# EAGLE schematic 8step_Seq (EAGLE 7.7.0)
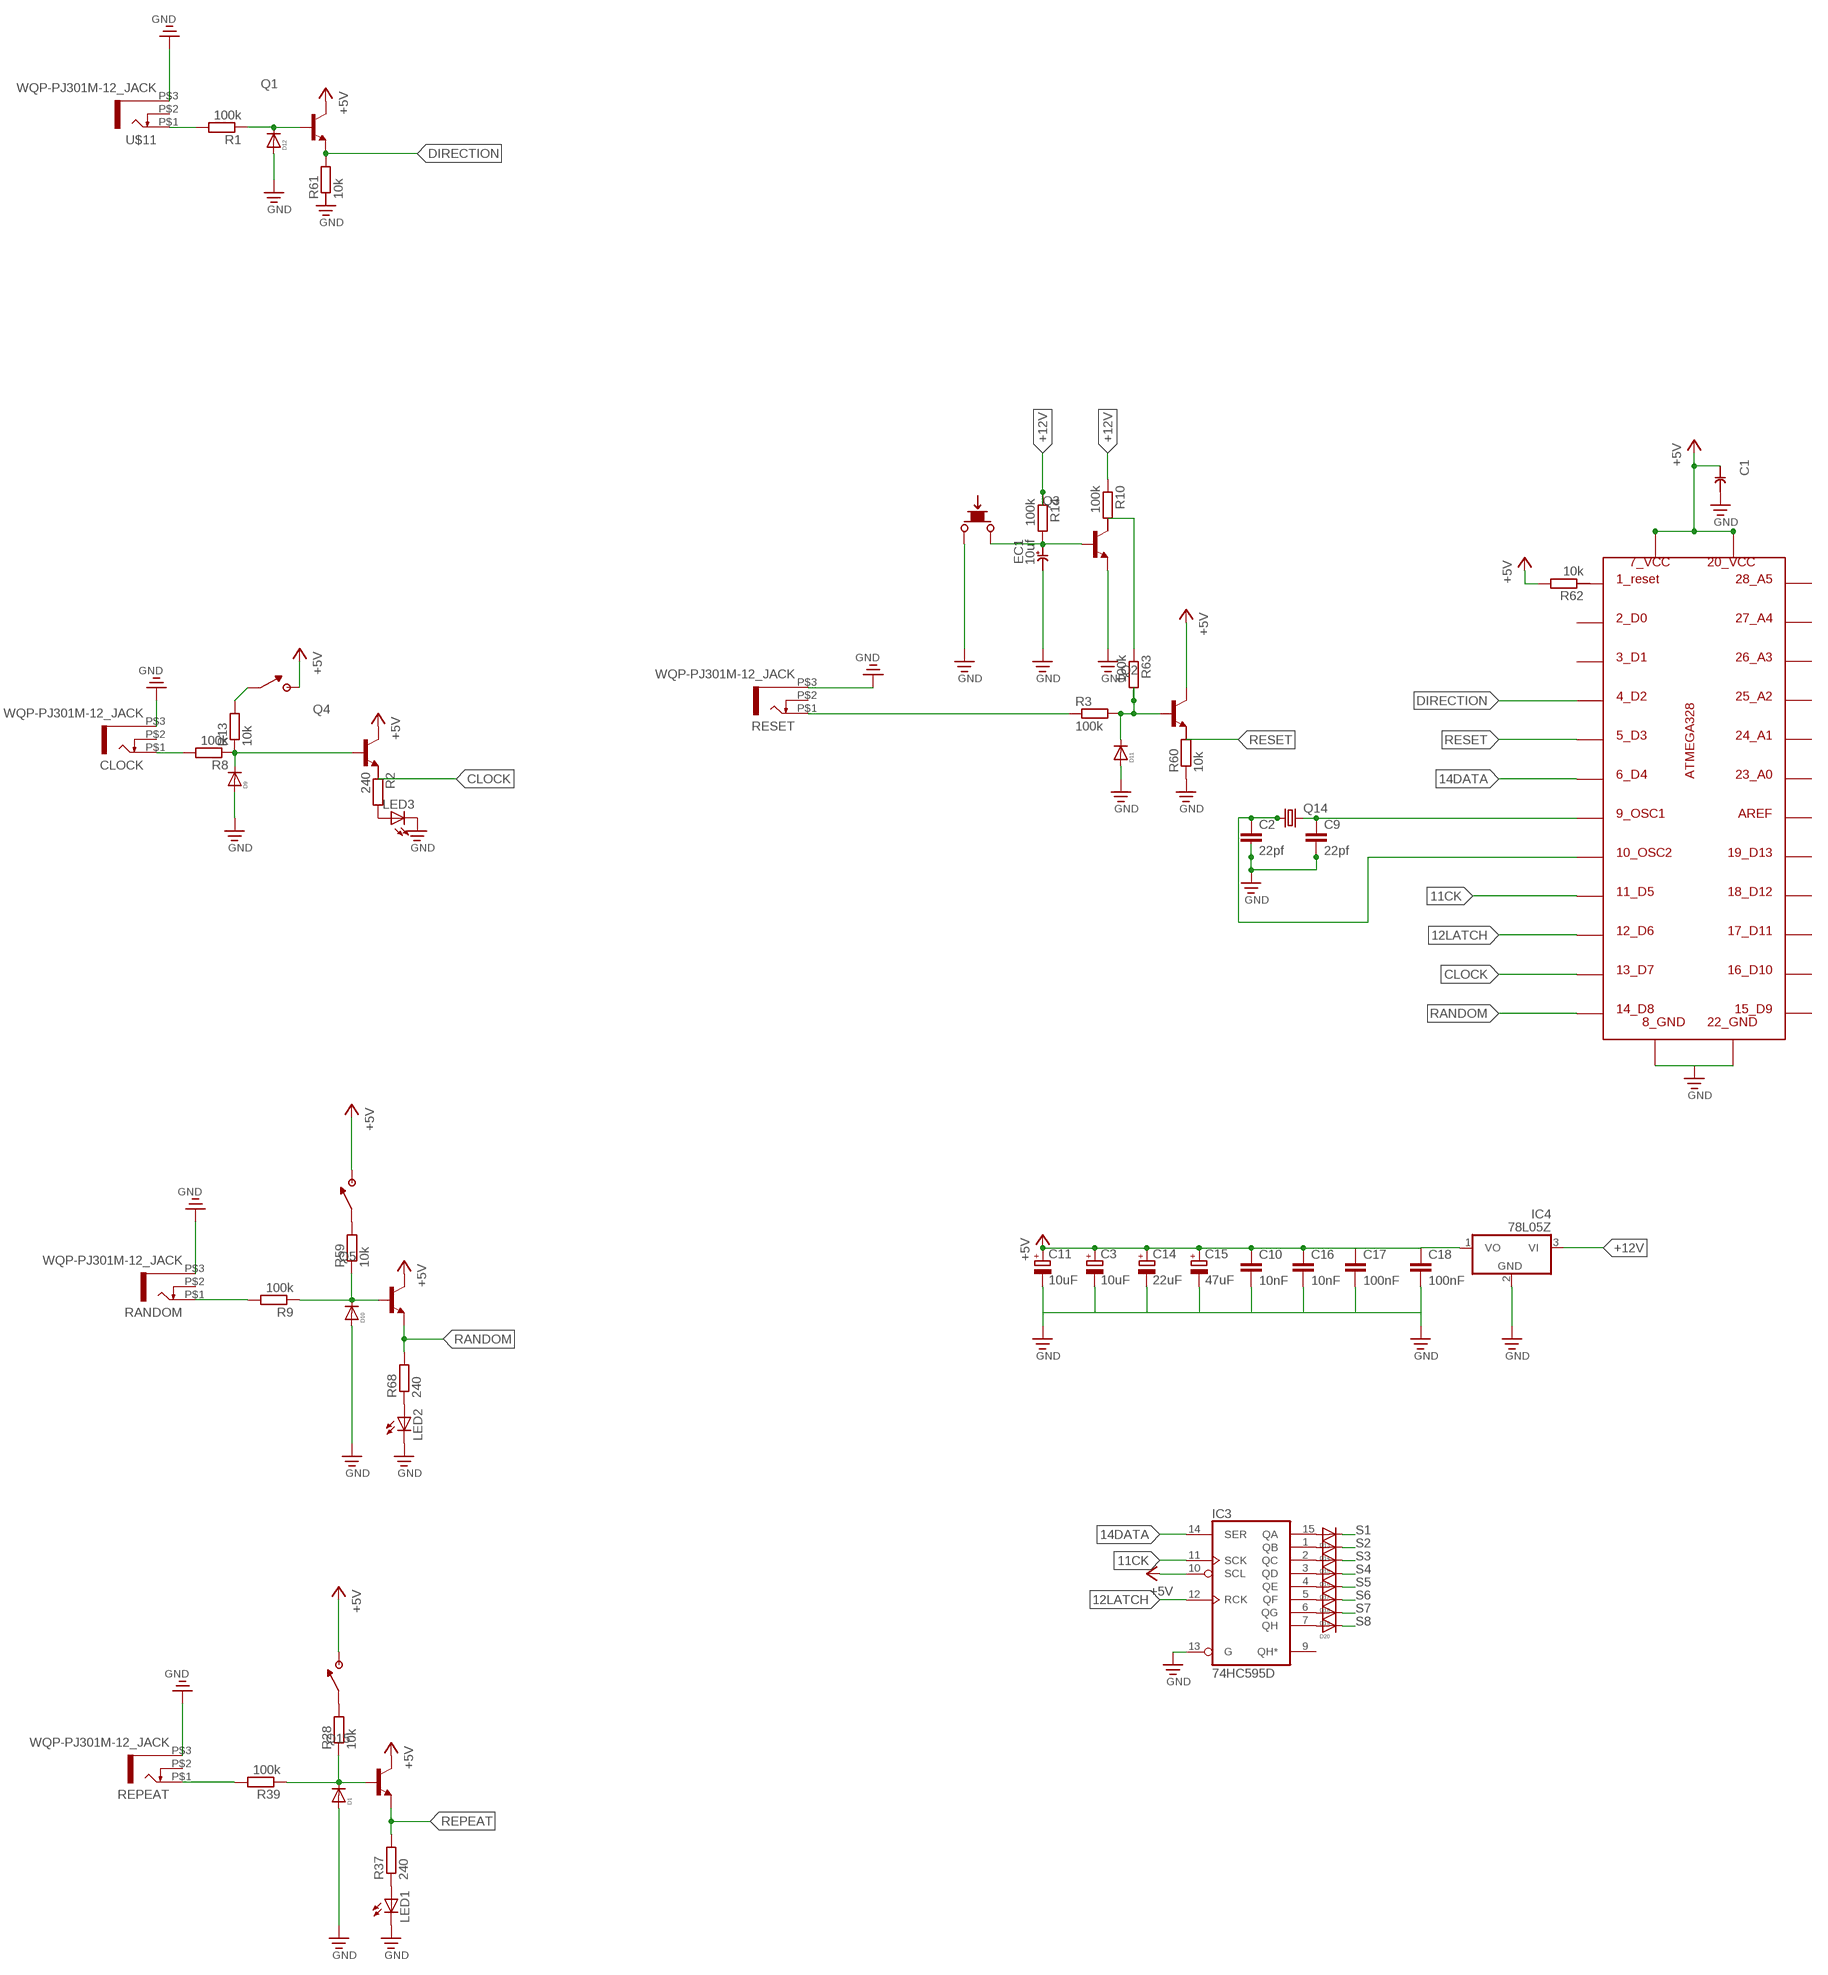
[diagram p0: schematic, sheet 1, part 1 of 2]
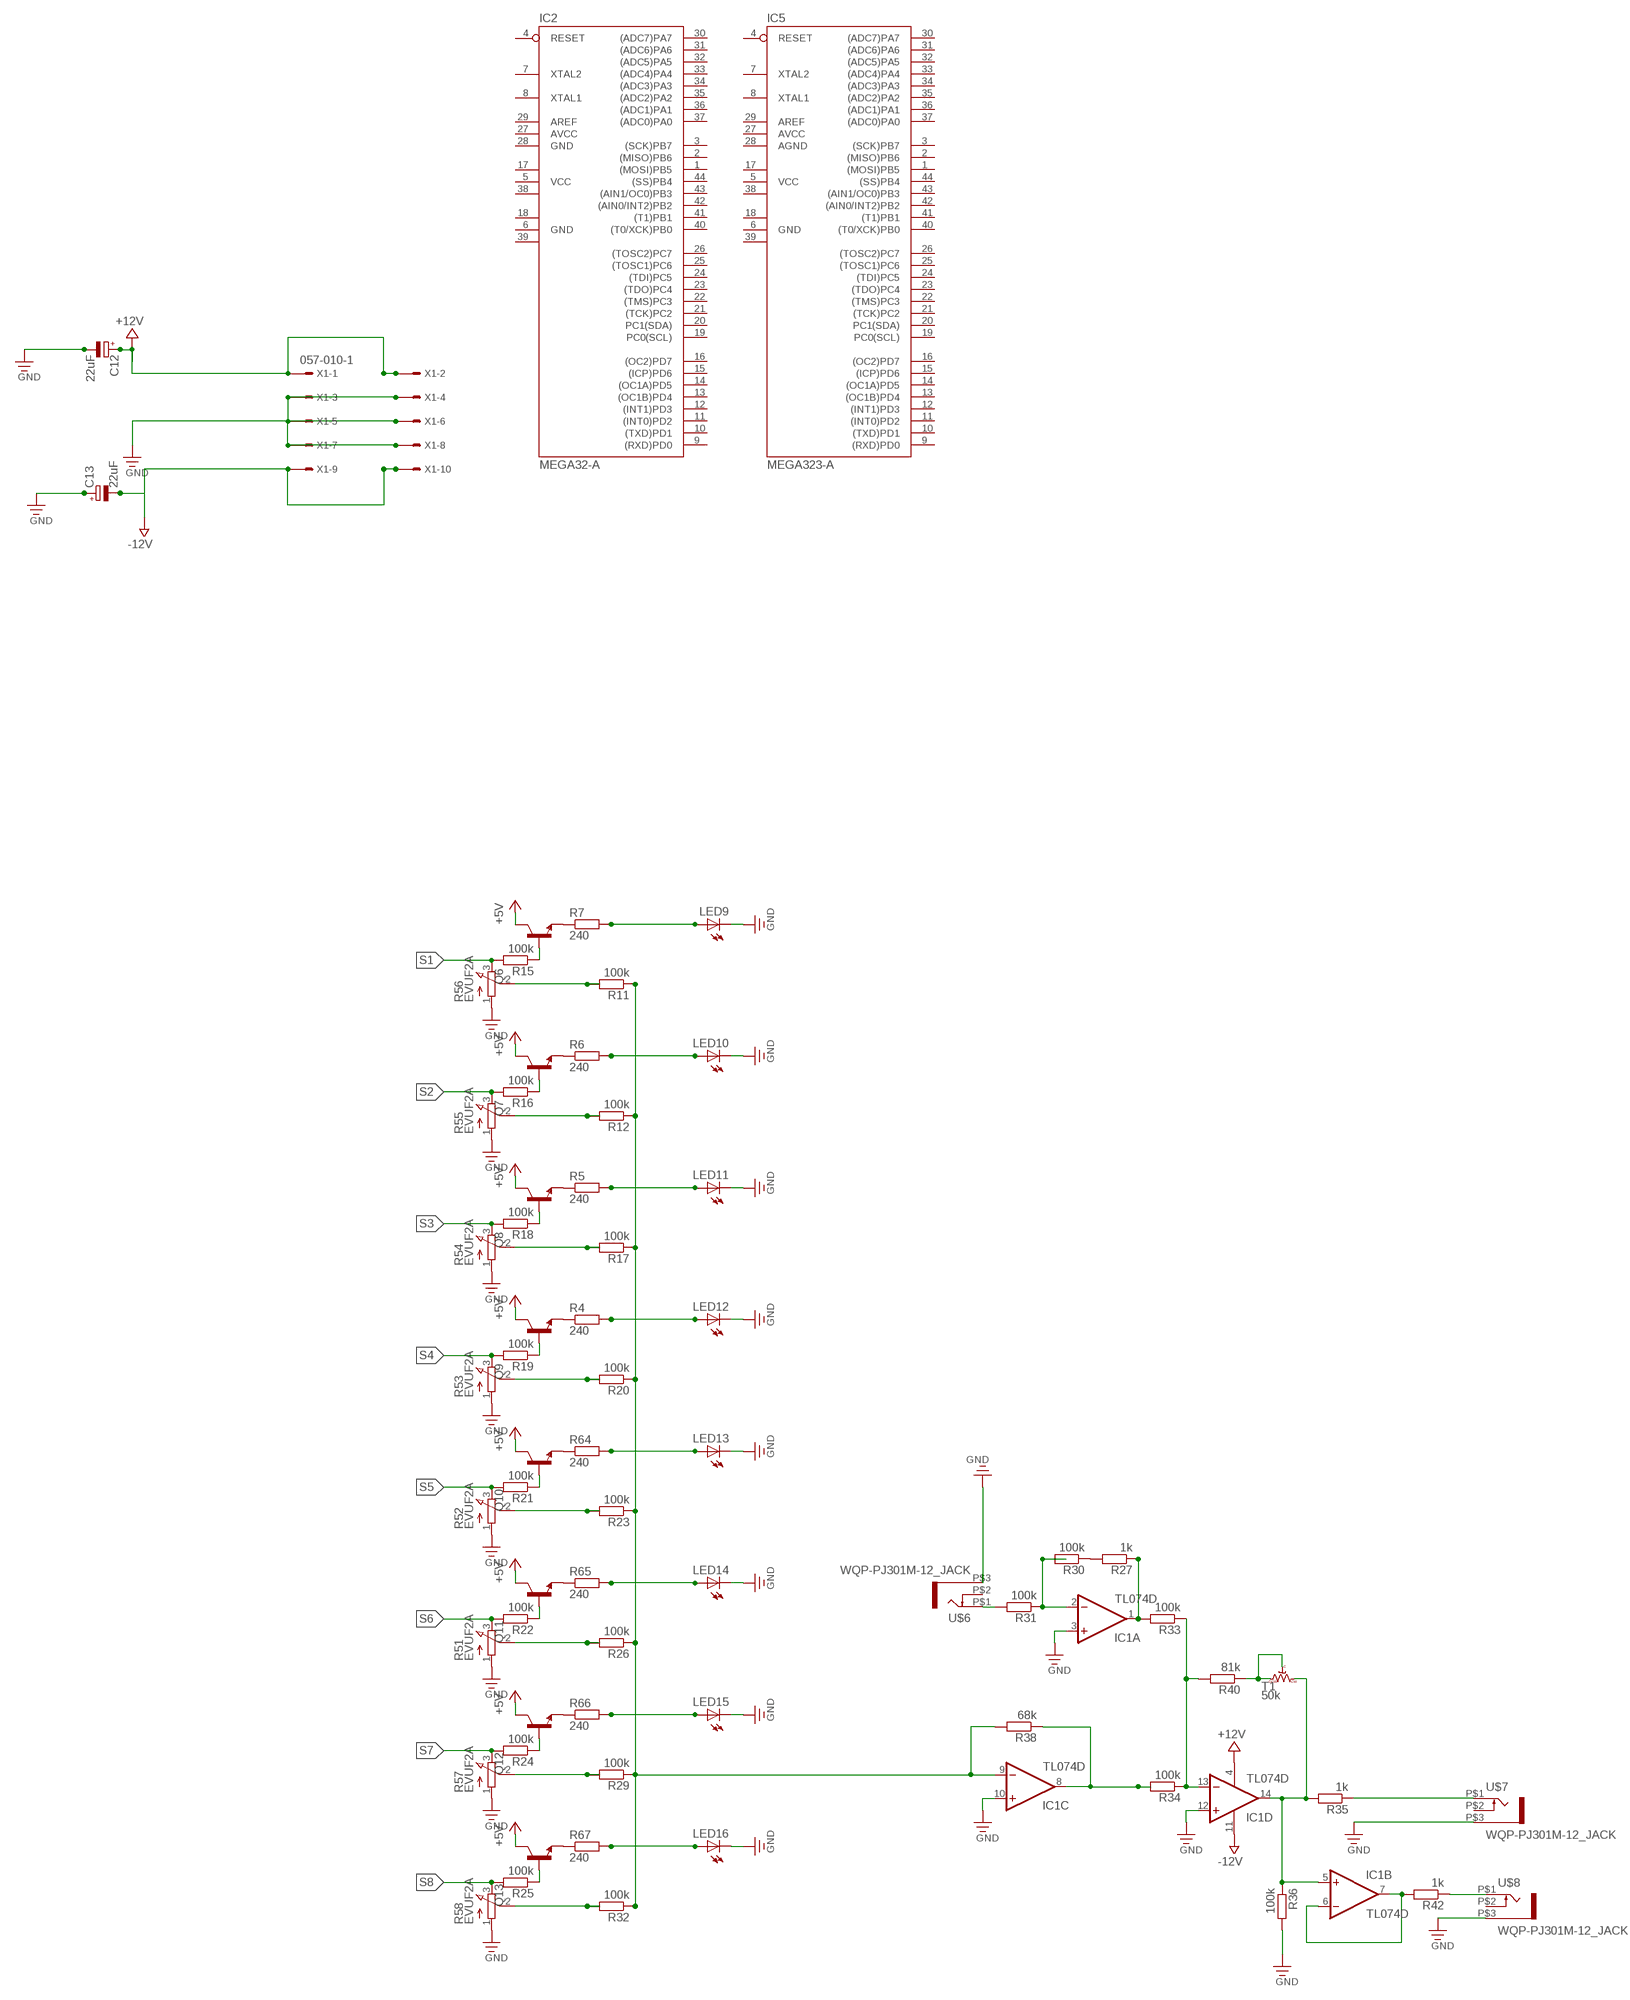
[diagram p1: schematic, sheet 1, part 2 of 2]

## Parts
C1  CAP  [CAP]
C2  22pf  C-EUC0805  [C0805]
C3  10uF  CPOL-EUD  [PANASONIC_D]
C9  22pf  C-EUC0805  [C0805]
C10  10nF  C-EUC0805  [C0805]
C11  10uF  CPOL-EUD  [PANASONIC_D]
C12  22uF  CPOL-EUD  [PANASONIC_D]
C13  22uF  CPOL-EUD  [PANASONIC_D]
C14  22uF  CPOL-EUD  [PANASONIC_D]
C15  47uF  CPOL-EUD  [PANASONIC_D]
C16  10nF  C-EUC0805  [C0805]
C17  100nF  C-EUC0805  [C0805]
C18  100nF  C-EUC0805  [C0805]
CLOCK  WQP-PJ301M-12_JACK  [WQP-PJ301M-12_JACK]
D1  1N4148DO35-7  [DO35-7]
D9  1N4148DO35-7  [DO35-7]
D10  1N4148DO35-7  [DO35-7]
D11  1N4148DO35-7  [DO35-7]
D12  1N4148DO35-7  [DO35-7]
D13  1N4148DO35-10  [DO35-10]
D14  1N4148DO35-10  [DO35-10]
D15  1N4148DO35-10  [DO35-10]
D16  1N4148DO35-10  [DO35-10]
D17  1N4148DO35-10  [DO35-10]
D18  1N4148DO35-10  [DO35-10]
D19  1N4148DO35-10  [DO35-10]
D20  1N4148DO35-10  [DO35-10]
EC1  10uf  E_CAP  [ELECTRO_CAP]
IC1  TL074D  [SO14]
IC2  MEGA32-A  [TQFP44]
IC3  74HC595D  [SO16]
IC4  78L05Z  [TO92]
IC5  MEGA323-A  [TQFP44]
LED1  LEDSML1206  [SML1206]
LED2  LEDSML1206  [SML1206]
LED3  LEDSML1206  [SML1206]
LED9  LEDSML1206  [SML1206]
LED10  LEDSML1206  [SML1206]
LED11  LEDSML1206  [SML1206]
LED12  LEDSML1206  [SML1206]
LED13  LEDSML1206  [SML1206]
LED14  LEDSML1206  [SML1206]
LED15  LEDSML1206  [SML1206]
LED16  LEDSML1206  [SML1206]
Q1  BC817-16LT1-NPN-SOT23-BEC  [SOT23-BEC]
Q2  BC817-16LT1-NPN-SOT23-BEC  [SOT23-BEC]
Q3  BC817-16LT1-NPN-SOT23-BEC  [SOT23-BEC]
Q4  BC817-16LT1-NPN-SOT23-BEC  [SOT23-BEC]
Q5  BC817-16LT1-NPN-SOT23-BEC  [SOT23-BEC]
Q6  BC817-16LT1-NPN-SOT23-BEC  [SOT23-BEC]
Q7  BC817-16LT1-NPN-SOT23-BEC  [SOT23-BEC]
Q8  BC817-16LT1-NPN-SOT23-BEC  [SOT23-BEC]
Q9  BC817-16LT1-NPN-SOT23-BEC  [SOT23-BEC]
Q10  BC817-16LT1-NPN-SOT23-BEC  [SOT23-BEC]
Q11  BC817-16LT1-NPN-SOT23-BEC  [SOT23-BEC]
Q12  BC817-16LT1-NPN-SOT23-BEC  [SOT23-BEC]
Q13  BC817-16LT1-NPN-SOT23-BEC  [SOT23-BEC]
Q14  CRYSTALHC49S  [HC49/S]
Q15  BC817-16LT1-NPN-SOT23-BEC  [SOT23-BEC]
R1  100k  R-EU_R0805  [R0805]
R2  240  R-EU_R0805  [R0805]
R3  100k  R-EU_R0805  [R0805]
R4  240  R-EU_R0805  [R0805]
R5  240  R-EU_R0805  [R0805]
R6  240  R-EU_R0805  [R0805]
R7  240  R-EU_R0805  [R0805]
R8  100k  R-EU_R0805  [R0805]
R9  100k  R-EU_R0805  [R0805]
R10  100k  R-EU_R0805  [R0805]
R11  100k  R-EU_R0805  [R0805]
R12  100k  R-EU_R0805  [R0805]
R13  10k  R-EU_R0805  [R0805]
R14  100k  R-EU_R0805  [R0805]
R15  100k  R-EU_R0805  [R0805]
R16  100k  R-EU_R0805  [R0805]
R17  100k  R-EU_R0805  [R0805]
R18  100k  R-EU_R0805  [R0805]
R19  100k  R-EU_R0805  [R0805]
R20  100k  R-EU_R0805  [R0805]
R21  100k  R-EU_R0805  [R0805]
R22  100k  R-EU_R0805  [R0805]
R23  100k  R-EU_R0805  [R0805]
R24  100k  R-EU_R0805  [R0805]
R25  100k  R-EU_R0805  [R0805]
R26  100k  R-EU_R0805  [R0805]
R27  1k  R-EU_R0805  [R0805]
R28  10k  R-EU_R0805  [R0805]
R29  100k  R-EU_R0805  [R0805]
R30  100k  R-EU_R0805  [R0805]
R31  100k  R-EU_R0805  [R0805]
R32  100k  R-EU_R0805  [R0805]
R33  100k  R-EU_R0805  [R0805]
R34  100k  R-EU_R0805  [R0805]
R35  1k  R-EU_R0805  [R0805]
R36  100k  R-EU_R0805  [R0805]
R37  240  R-EU_R0805  [R0805]
R38  68k  R-EU_R0805  [R0805]
R39  100k  R-EU_R0805  [R0805]
R40  81k  R-EU_R0805  [R0805]
R42  1k  R-EU_R0805  [R0805]
R51  EVUF2A  [EVUF]
R52  EVUF2A  [EVUF]
R53  EVUF2A  [EVUF]
R54  EVUF2A  [EVUF]
R55  EVUF2A  [EVUF]
R56  EVUF2A  [EVUF]
R57  EVUF2A  [EVUF]
R58  EVUF2A  [EVUF]
R59  10k  R-EU_R0805  [R0805]
R60  10k  R-EU_R0805  [R0805]
R61  10k  R-EU_R0805  [R0805]
R62  10k  R-EU_R0805  [R0805]
R63  100k  R-EU_R0805  [R0805]
R64  240  R-EU_R0805  [R0805]
R65  240  R-EU_R0805  [R0805]
R66  240  R-EU_R0805  [R0805]
R67  240  R-EU_R0805  [R0805]
R68  240  R-EU_R0805  [R0805]
RANDOM  WQP-PJ301M-12_JACK  [WQP-PJ301M-12_JACK]
RANDOMS  SPST  [SPST]
RANDOMS1  SPST  [SPST]
REPEAT  WQP-PJ301M-12_JACK  [WQP-PJ301M-12_JACK]
RESET  WQP-PJ301M-12_JACK  [WQP-PJ301M-12_JACK]
STEP  SPST_MOMENTARY  [SPST]
T1  50k  TRIM  [TRIM]
TOGGLE  SPST  [SPST]
U$2  ATMEGA328  [DIL28]
U$6  WQP-PJ301M-12_JACK  [WQP-PJ301M-12_JACK]
U$7  WQP-PJ301M-12_JACK  [WQP-PJ301M-12_JACK]
U$8  WQP-PJ301M-12_JACK  [WQP-PJ301M-12_JACK]
U$11  WQP-PJ301M-12_JACK  [WQP-PJ301M-12_JACK]
X1  057-010-1  [057-010-1]

## Nets
11CK: IC3.11(SCK) U$2.P$11(P$11_D5)
12LATCH: IC3.12(RCK) U$2.P$12(P$12_D6)
14DATA: IC3.14(SER) U$2.P$6(P$6_D4)
+5V: C1.P$1 C3.+ C10.1 C11.+ C14.+ C15.+ C16.1 C18.1 IC3.10(SCL) IC4.1(VO) Q1.C Q2.C Q4.C Q5.C Q6.C Q7.C Q8.C Q9.C Q10.C Q11.C Q12.C Q13.C Q15.C R62.2 RANDOMS1.P$2 RANDOMS.P$2 TOGGLE.P$2 U$2.P$7(P$7_VCC) U$2.P$20(P$20_VCC)
+12V: C12.+ IC1.4(P:V+) IC4.3(VI) R10.1 R14.1 X1.1 X1.2
-12V: C13.- IC1.11(P:V-) X1.9 X1.10
CLOCK: Q4.E U$2.P$13(P$13_D7)
DIRECTION: Q1.E R61.2 U$2.P$4(P$4_D2)
GND: C1.P$2 C2.2 C3.- C9.2 C10.2 C11.- C12.- C13.+ C14.- C15.- C16.2 C17.2 C18.2 CLOCK.P$3 D1.A D9.A D10.A D11.A D12.A EC1.P$2 IC1.3(A:+IN) IC1.10(C:+IN) IC1.12(D:+IN) IC3.13(G) IC4.2(GND) LED1.C LED2.C LED3.C LED9.C LED10.C LED11.C LED12.C LED13.C LED14.C LED15.C LED16.C Q3.E R36.2 R51.1(A) R52.1(A) R53.1(A) R54.1(A) R55.1(A) R56.1(A) R57.1(A) R58.1(A) R60.1 RANDOM.P$3 REPEAT.P$3 RESET.P$3 STEP.P$2 U$2.P$8(P$8_GND) U$2.P$22(P$22_GND) U$6.P$3 U$7.P$3 U$8.P$3 U$11.P$3 X1.3 X1.4 X1.5 X1.6 X1.7 X1.8
N$1: C9.1 Q14.2 U$2.P$9(P$9_OSC1)
N$2: C2.1 Q14.1 U$2.P$10(P$10_OSC2)
N$3: D13.A IC3.15(QA)
N$4: D14.A IC3.1(QB)
N$5: D15.A IC3.2(QC)
N$6: R27.2 R30.1
N$7: R3.1 RESET.P$1
N$8: D12.C Q1.B R1.1
N$9: R42.1 U$8.P$1
N$10: Q13.E R67.1
N$11: D11.C Q2.B R3.2 R63.2
N$12: Q3.C R63.1
N$13: EC1.P$1 Q3.B R14.2 STEP.P$1
N$14: D1.C Q15.B R28.1 R39.1
N$15: CLOCK.P$1 R8.2
N$16: D9.C Q4.B R8.1 R13.1
N$17: R13.2 TOGGLE.P$1
N$18: R9.2 RANDOM.P$1
N$19: D10.C Q5.B R9.1 R59.1
N$20: R28.2 RANDOMS1.P$1
N$21: R59.2 RANDOMS.P$1
N$22: Q12.E R66.1
N$23: LED1.A R37.1
N$24: R39.2 REPEAT.P$1
N$32: Q13.B R25.1
N$33: R11.2 R56.2(S)
N$34: LED9.A R7.2
N$36: Q12.B R24.1
N$37: R12.2 R55.2(S)
N$38: LED10.A R6.2
N$40: Q11.B R22.1
N$41: R17.2 R54.2(S)
N$42: LED11.A R5.2
N$44: Q10.B R21.1
N$45: R20.2 R53.2(S)
N$46: LED12.A R4.2
N$48: Q9.B R19.1
N$49: R23.2 R52.2(S)
N$50: LED13.A R64.2
N$52: Q8.B R18.1
N$53: R26.2 R51.2(S)
N$54: LED14.A R65.2
N$56: Q7.B R16.1
N$57: R29.2 R57.2(S)
N$58: LED15.A R66.2
N$60: Q6.B R15.1
N$61: R32.2 R58.2(S)
N$62: LED16.A R67.2
N$63: IC1.9(C:-IN) R11.1 R12.1 R17.1 R20.1 R23.1 R26.1 R29.1 R32.1 R38.2
N$64: R35.1 U$7.P$1
N$65: IC1.8(C:OUT) R34.2 R38.1
N$66: IC1.13(D:-IN) R33.1 R34.1 R40.2
N$67: IC1.5(B:+IN) IC1.14(D:OUT) R35.2 R36.1 T1.CW
N$68: R40.1 T1.C T1.CCW
N$69: IC1.1(A:OUT) R27.1 R33.2
N$71: R31.2 U$6.P$1
N$72: IC1.2(A:-IN) R30.2 R31.1
N$74: IC1.6(B:-IN) IC1.7(B:OUT) R42.2
N$79: Q11.E R65.1
N$80: Q10.E R64.1
N$81: Q9.E R4.1
N$82: Q7.E R6.1
N$83: Q6.E R7.1
N$84: LED2.A R68.1
N$85: LED3.A R2.2
N$86: R1.2 U$11.P$1
N$89: Q8.E R5.1
N$90: D16.A IC3.3(QD)
N$91: D17.A IC3.4(QE)
N$92: D18.A IC3.5(QF)
N$93: D19.A IC3.6(QG)
N$94: D20.A IC3.7(QH)
RANDOM: Q5.E R68.2 U$2.P$14(P$14_D8)
REPEAT: Q15.E R37.2
RESET: Q2.E U$2.P$5(P$5_D3)
S1: D13.C R15.2 R56.3(E)
S2: D14.C R16.2 R55.3(E)
S3: D15.C R18.2 R54.3(E)
S4: D16.C R19.2 R53.3(E)
S5: D17.C R21.2 R52.3(E)
S6: D18.C R22.2 R51.3(E)
S7: D19.C R24.2 R57.3(E)
S8: D20.C R25.2 R58.3(E)
Unconnected: C17.1 CLOCK.P$2 IC2.1((MOSI)PB5) IC2.2((MISO)PB6) IC2.3((SCK)PB7) IC2.4(RESET) IC2.7(XTAL2) IC2.8(XTAL1) IC2.9((RXD)PD0) IC2.10((TXD)PD1) IC2.11((INT0)PD2) IC2.12((INT1)PD3) IC2.13((OC1B)PD4) IC2.14((OC1A)PD5) IC2.15((ICP)PD6) IC2.16((OC2)PD7) IC2.19(PC0(SCL)) IC2.20(PC1(SDA)) IC2.21((TCK)PC2) IC2.22((TMS)PC3) IC2.23((TDO)PC4) IC2.24((TDI)PC5) IC2.25((TOSC1)PC6) IC2.26((TOSC2)PC7) IC2.29(AREF) IC2.30((ADC7)PA7) IC2.31((ADC6)PA6) IC2.32((ADC5)PA5) IC2.33((ADC4)PA4) IC2.34((ADC3)PA3) IC2.35((ADC2)PA2) IC2.36((ADC1)PA1) IC2.37((ADC0)PA0) IC2.40((T0/XCK)PB0) IC2.41((T1)PB1) IC2.42((AIN0/INT2)PB2) IC2.43((AIN1/OC0)PB3) IC2.44((SS)PB4) IC3.9(QH*) IC5.1((MOSI)PB5) IC5.2((MISO)PB6) IC5.3((SCK)PB7) IC5.4(RESET) IC5.7(XTAL2) IC5.8(XTAL1) IC5.9((RXD)PD0) IC5.10((TXD)PD1) IC5.11((INT0)PD2) IC5.12((INT1)PD3) IC5.13((OC1B)PD4) IC5.14((OC1A)PD5) IC5.15((ICP)PD6) IC5.16((OC2)PD7) IC5.19(PC0(SCL)) IC5.20(PC1(SDA)) IC5.21((TCK)PC2) IC5.22((TMS)PC3) IC5.23((TDO)PC4) IC5.24((TDI)PC5) IC5.25((TOSC1)PC6) IC5.26((TOSC2)PC7) IC5.29(AREF) IC5.30((ADC7)PA7) IC5.31((ADC6)PA6) IC5.32((ADC5)PA5) IC5.33((ADC4)PA4) IC5.34((ADC3)PA3) IC5.35((ADC2)PA2) IC5.36((ADC1)PA1) IC5.37((ADC0)PA0) IC5.40((T0/XCK)PB0) IC5.41((T1)PB1) IC5.42((AIN0/INT2)PB2) IC5.43((AIN1/OC0)PB3) IC5.44((SS)PB4) R2.1 R10.2 R60.2 R61.1 R62.1 RANDOM.P$2 REPEAT.P$2 RESET.P$2 U$2.P$1(P$1_RESET) U$2.P$2(P$2_D0) U$2.P$3(P$3_D1) U$2.P$15(P$15_D9) U$2.P$16(P$16_D10) U$2.P$17(P$17_D11) U$2.P$18(P$18_D12) U$2.P$19(P$19_D13) U$2.P$21(P$21_AREF) U$2.P$23(P$23_A0) U$2.P$24(P$24_A1) U$2.P$25(P$25_A2) U$2.P$26(P$26_A3) U$2.P$27(P$27_A4) U$2.P$28(P$28_A5) U$6.P$2 U$7.P$2 U$8.P$2 U$11.P$2

## Power pins joined to a net without a drawn wire
AGND: IC5.28(AGND)
AVCC: IC2.27(AVCC) IC5.27(AVCC)
GND: IC2.6(GND) IC2.28(GND) IC3.8(GND) IC5.6(GND)
GND1: IC2.18(GND1) IC5.18(GND1)
GND2: IC2.39(GND2) IC5.39(GND2)
VCC: IC2.5(VCC) IC3.16(VCC) IC5.5(VCC)
VCC1: IC2.17(VCC1) IC5.17(VCC1)
VCC2: IC2.38(VCC2) IC5.38(VCC2)

## Library data of the parts
C1 = 001-etchable:CAP
C2 C9 C10 C16-C18 = resistor:C-EU: CAPACITOR, European symbol
C3 C11-C15 = resistor:CPOL-EU: POLARIZED CAPACITOR, European symbol
CLOCK RANDOM REPEAT RESET U$6-U$8 U$11 = thonkiconn:WQP-PJ301M-12_JACK
D1 D9-D20 = 001-etchable:1N4148: DIODE high speed (Philips)
EC1 = 001-etchable:E_CAP
IC1 = linear:TL074: OP AMP
IC2 = atmel:MEGA32: MICROCONTROLLER 32 Kbytes FLASH 2 Kbytes SRAM 1 Kbytes EEPROM USART 8-channel 10 bit ADC Source: www.atmel.com .. doc2503.pdf; MPN: ATMEGA32-16AU; OC_FARNELL: 9171274; OC_NEWARK: 69K6677
IC3 = 74xx-eu:74*595: 8-bit SHIFT REGISTER, output latch
IC4 = linear:78*: Positive VOLTAGE REGULATOR Source: http://cache.national.com/ds/LM/LM78L05.pdf http://www.fairchildsemi.com/ds/LM/LM7805.pdf
IC5 = atmel:MEGA323: MICROCONTROLLER 32 Kbytes FLASH 2 Kbytes SRAM 1 Kbytes EEPROM USART 8-channel 10 bit ADC Source: avr.lbr; OC_FARNELL: unknown; OC_NEWARK: unknown
LED1-LED3 LED9-LED16 = led:LED: LED OSRAM: - CHIPLED LG R971, LG N971, LY N971, LG Q971, LY Q971, LO R971, LY R971 LH N974, LH R974 LS Q976, LO Q976, LY Q976 LO Q996 - Hyper CHIPLED LW Q18S LB Q993, LB Q99A, LB R99A - SideLED LS A670, LO A670, LY A670, LG A670, LP A670 LB A673, LV A673, LT A673, LW A673 LH A674 LY A675 LS A676, LA A676, LO A676, LY A676, LW A676 LS A679, LY A679, LG A679 - Hyper Micro SIDELED® LS Y876, LA Y876, LO Y876, LY Y876 LT Y87S - SmartLED LW L88C, LW L88S LB L89C, LB L89S, LG L890 LS L89K, LO L89K, LY L89K LS L896, LA L896, LO L896, LY L896 - TOPLED LS T670, LO T670, LY T670, LG T670, LP T670 LSG T670, LSP T670, LSY T670, LOP T670, LYG T670 LG T671, LOG T671, LSG T671 LB T673, LV T673, LT T673, LW T673 LH T674 LS T676, LA T676, LO T676, LY T676, LB T676, LH T676, LSB T676, LW T676 LB T67C, LV T67C, LT T67C, LS T67K, LO T67K, LY T67K, LW E67C LS E67B, LA E67B, LO E67B, LY E67B, LB E67C, LV E67C, LT E67C LW T67C LS T679, LY T679, LG T679 LS T770, LO T770, LY T770, LG T770, LP T770 LB T773, LV T773, LT T773, LW T773 LH T774 LS E675, LA E675, LY E675, LS T675 LS T776, LA T776, LO T776, LY T776, LB T776 LHGB T686 LT T68C, LB T68C - Hyper Mini TOPLED® LB M676 - Mini TOPLED Santana® LG M470 LS M47K, LO M47K, LY M47K Source: http://www.osram.convergy.de LUXEON: - LUMILED® LXK2-PW12-R00, LXK2-PW12-S00, LXK2-PW14-U00, LXK2-PW14-V00 LXK2-PM12-R00, LXK2-PM12-S00, LXK2-PM14-U00 LXK2-PE12-Q00, LXK2-PE12-R00, LXK2-PE12-S00, LXK2-PE14-T00, LXK2-PE14-U00 LXK2-PB12-K00, LXK2-PB12-L00, LXK2-PB12-M00, LXK2-PB14-N00, LXK2-PB14-P00, LXK2-PB14-Q00 LXK2-PR12-L00, LXK2-PR12-M00, LXK2-PR14-Q00, LXK2-PR14-R00 LXK2-PD12-Q00, LXK2-PD12-R00, LXK2-PD12-S00 LXK2-PH12-R00, LXK2-PH12-S00 LXK2-PL12-P00, LXK2-PL12-Q00, LXK2-PL12-R00 Source: www.luxeon.com KINGBRIGHT: KA-3528ASYC Source: www.kingbright.com
Q1-Q13 Q15 = transistor:*-NPN-: NPN Transistror BF959 corrected 2008.03.06
Q14 = crystal:CRYSTAL: CRYSTAL; OC_FARNELL: 1667008; OC_NEWARK: unknown
R1-R40 R42 R59-R68 = resistor:R-EU_: RESISTOR, European symbol
R51-R58 = pot:EVU: 9 mm Square Rotary Potentiometers Source: Panasonic
RANDOMS RANDOMS1 TOGGLE = 001-etchable:SPST
STEP = 001-etchable:SPST_MOMENTARY
T1 = 001-etchable:TRIM
U$2 = 001-etchable:ATMEGA328
X1 = con-panduit:057-010-: CONNECTOR 10-pin series 057 contact pc board low profile headers; OC_FARNELL: unknown; OC_NEWARK: unknown